# EAGLE schematic videoshield_alpha3 (EAGLE 6.6.0)
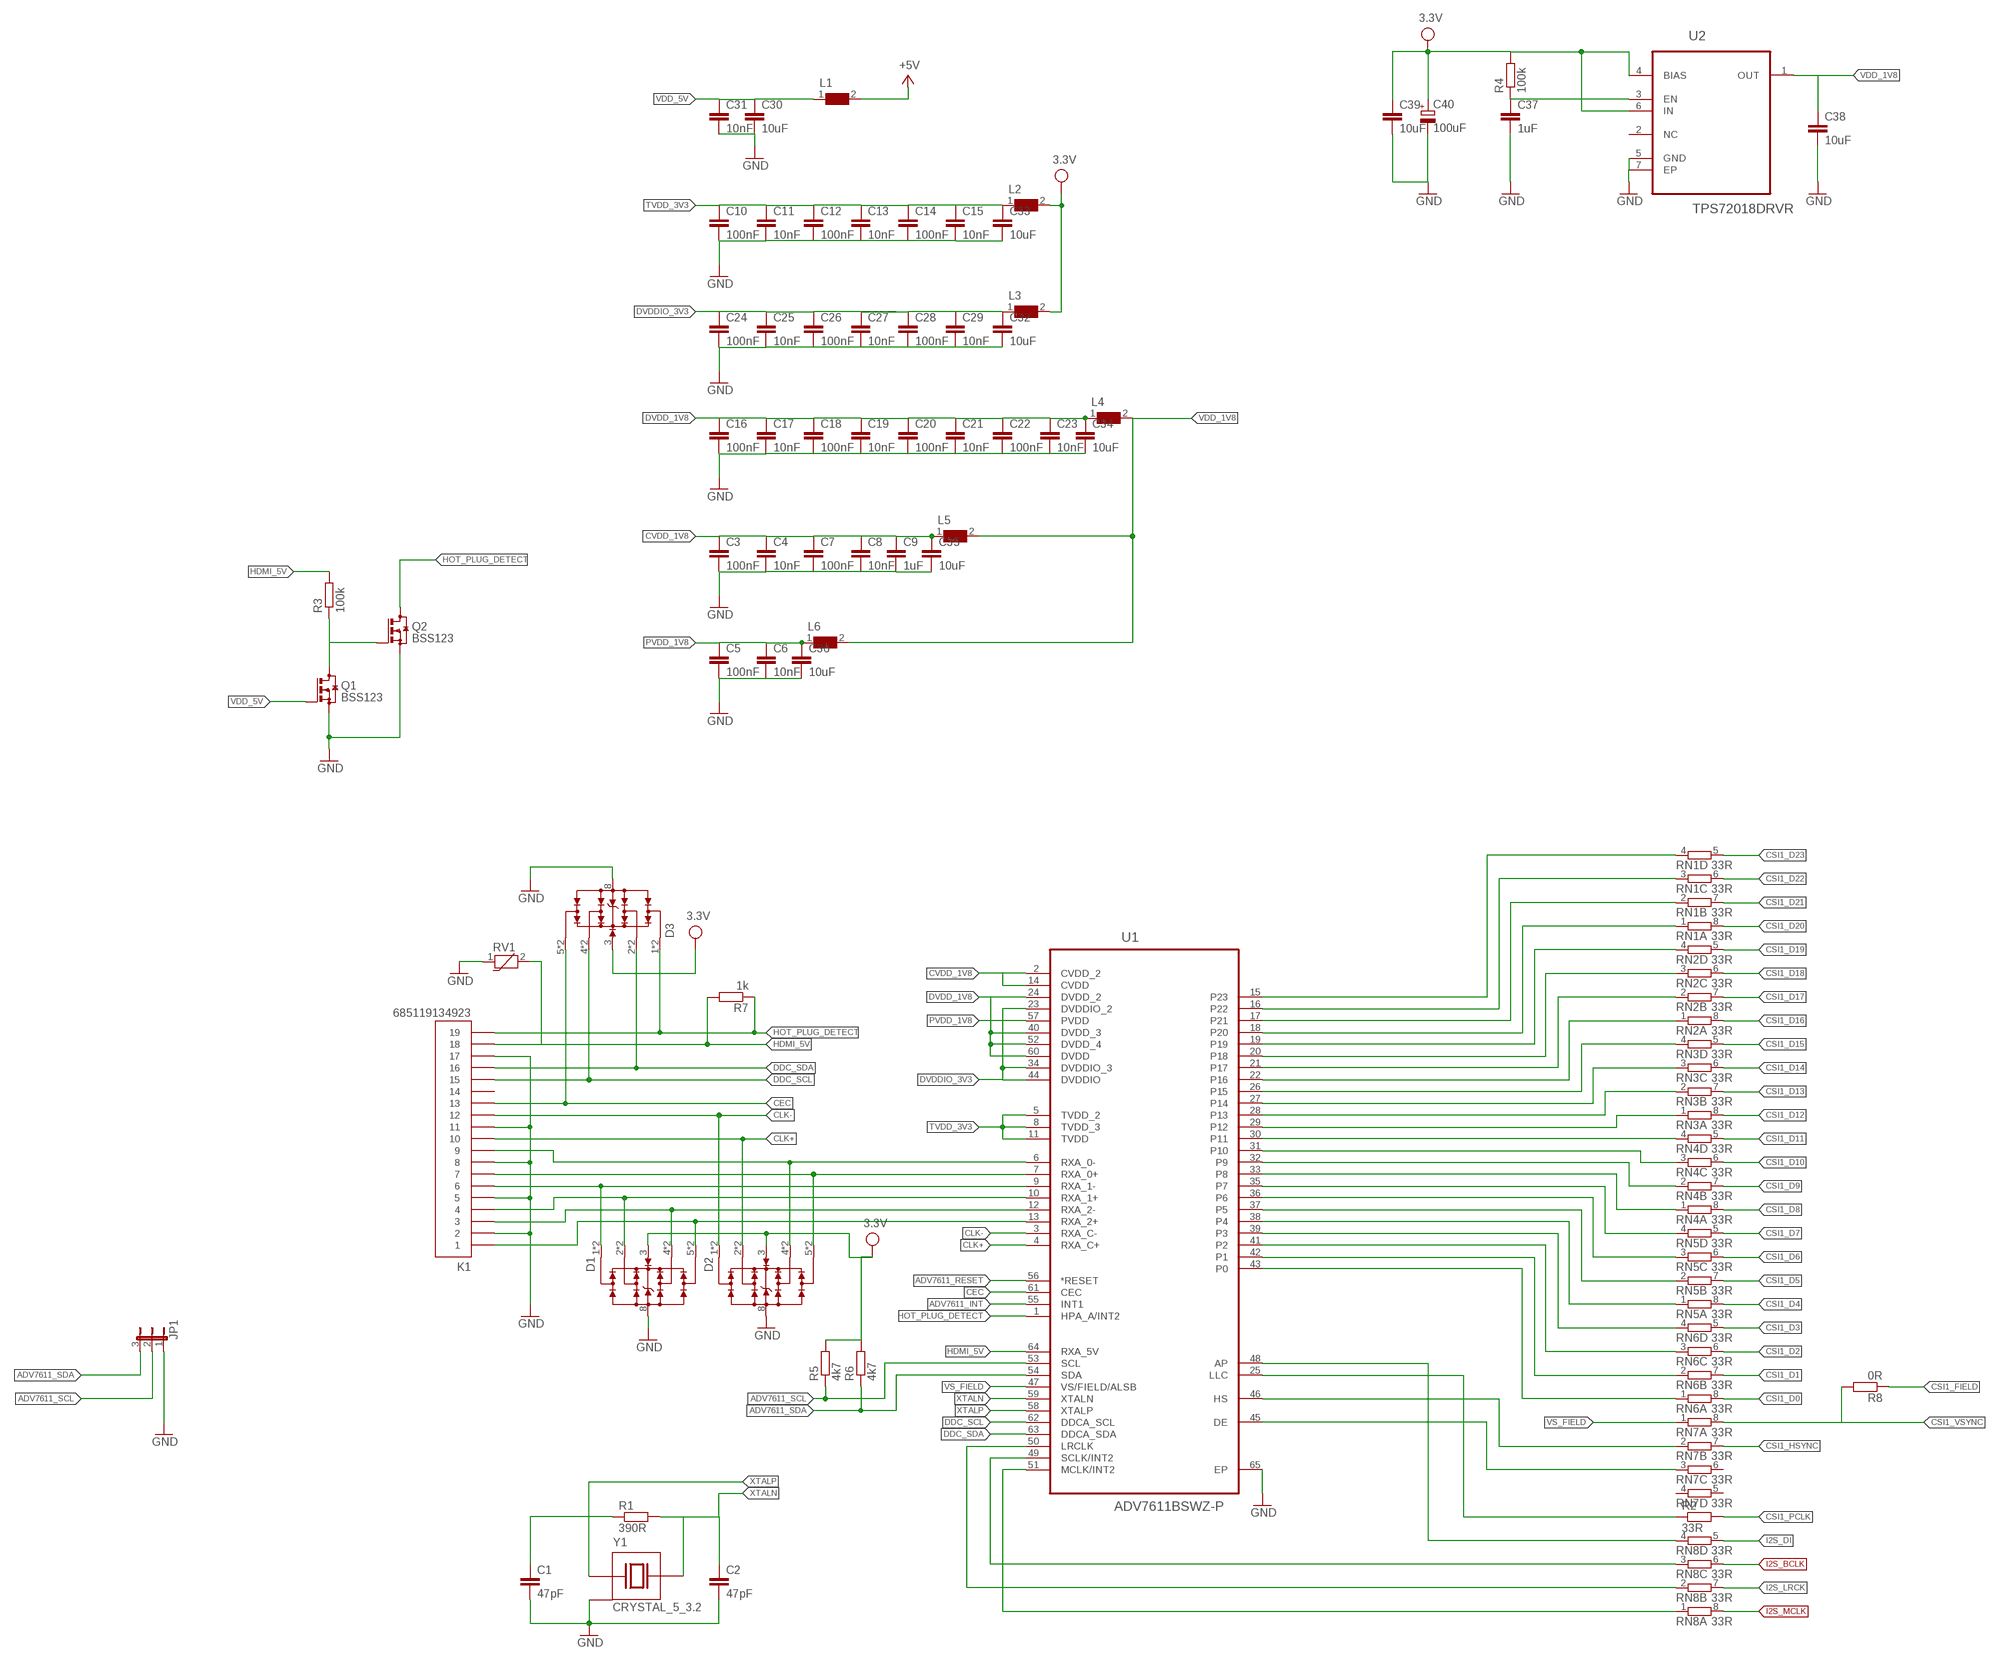
[diagram p0: schematic, sheet 1, part 1 of 3]
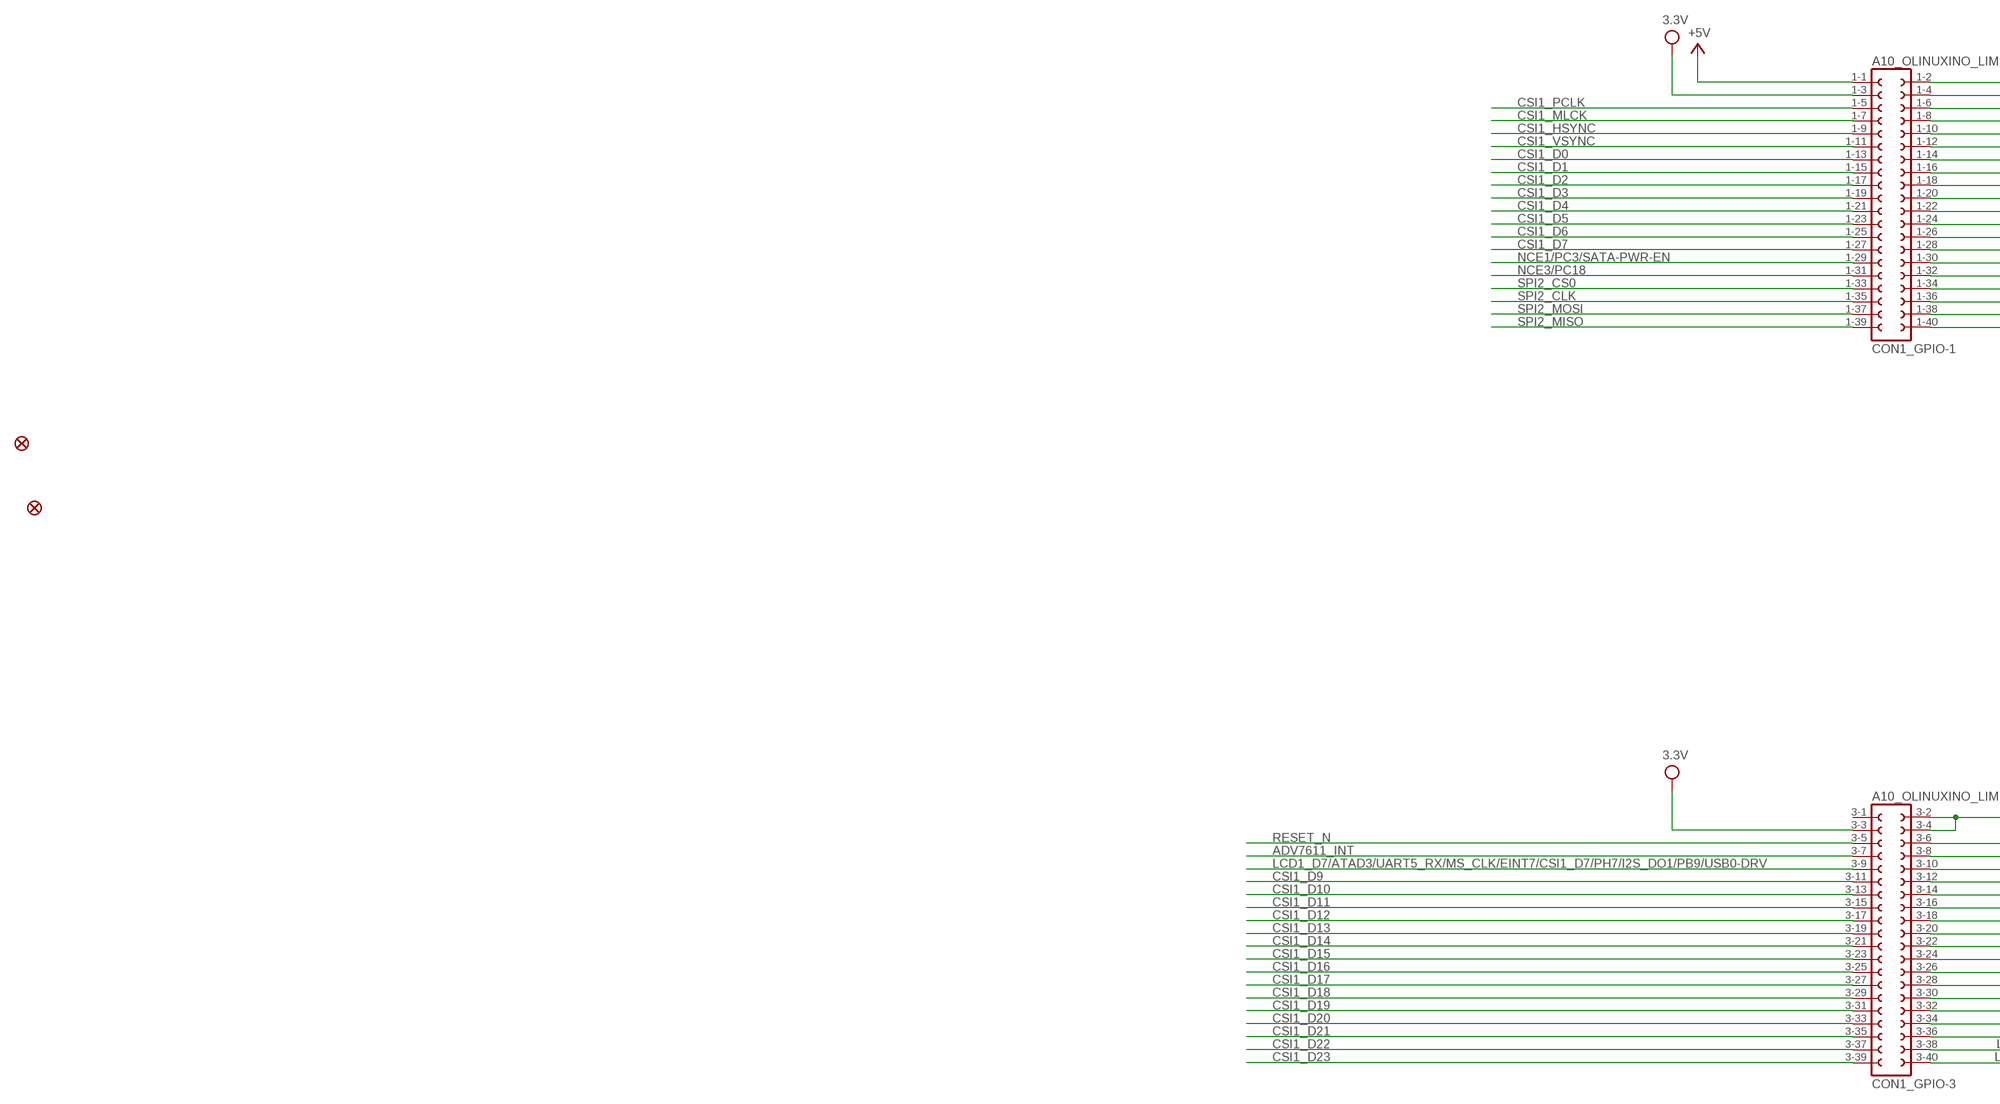
[diagram p1: schematic, sheet 1, part 2 of 3]
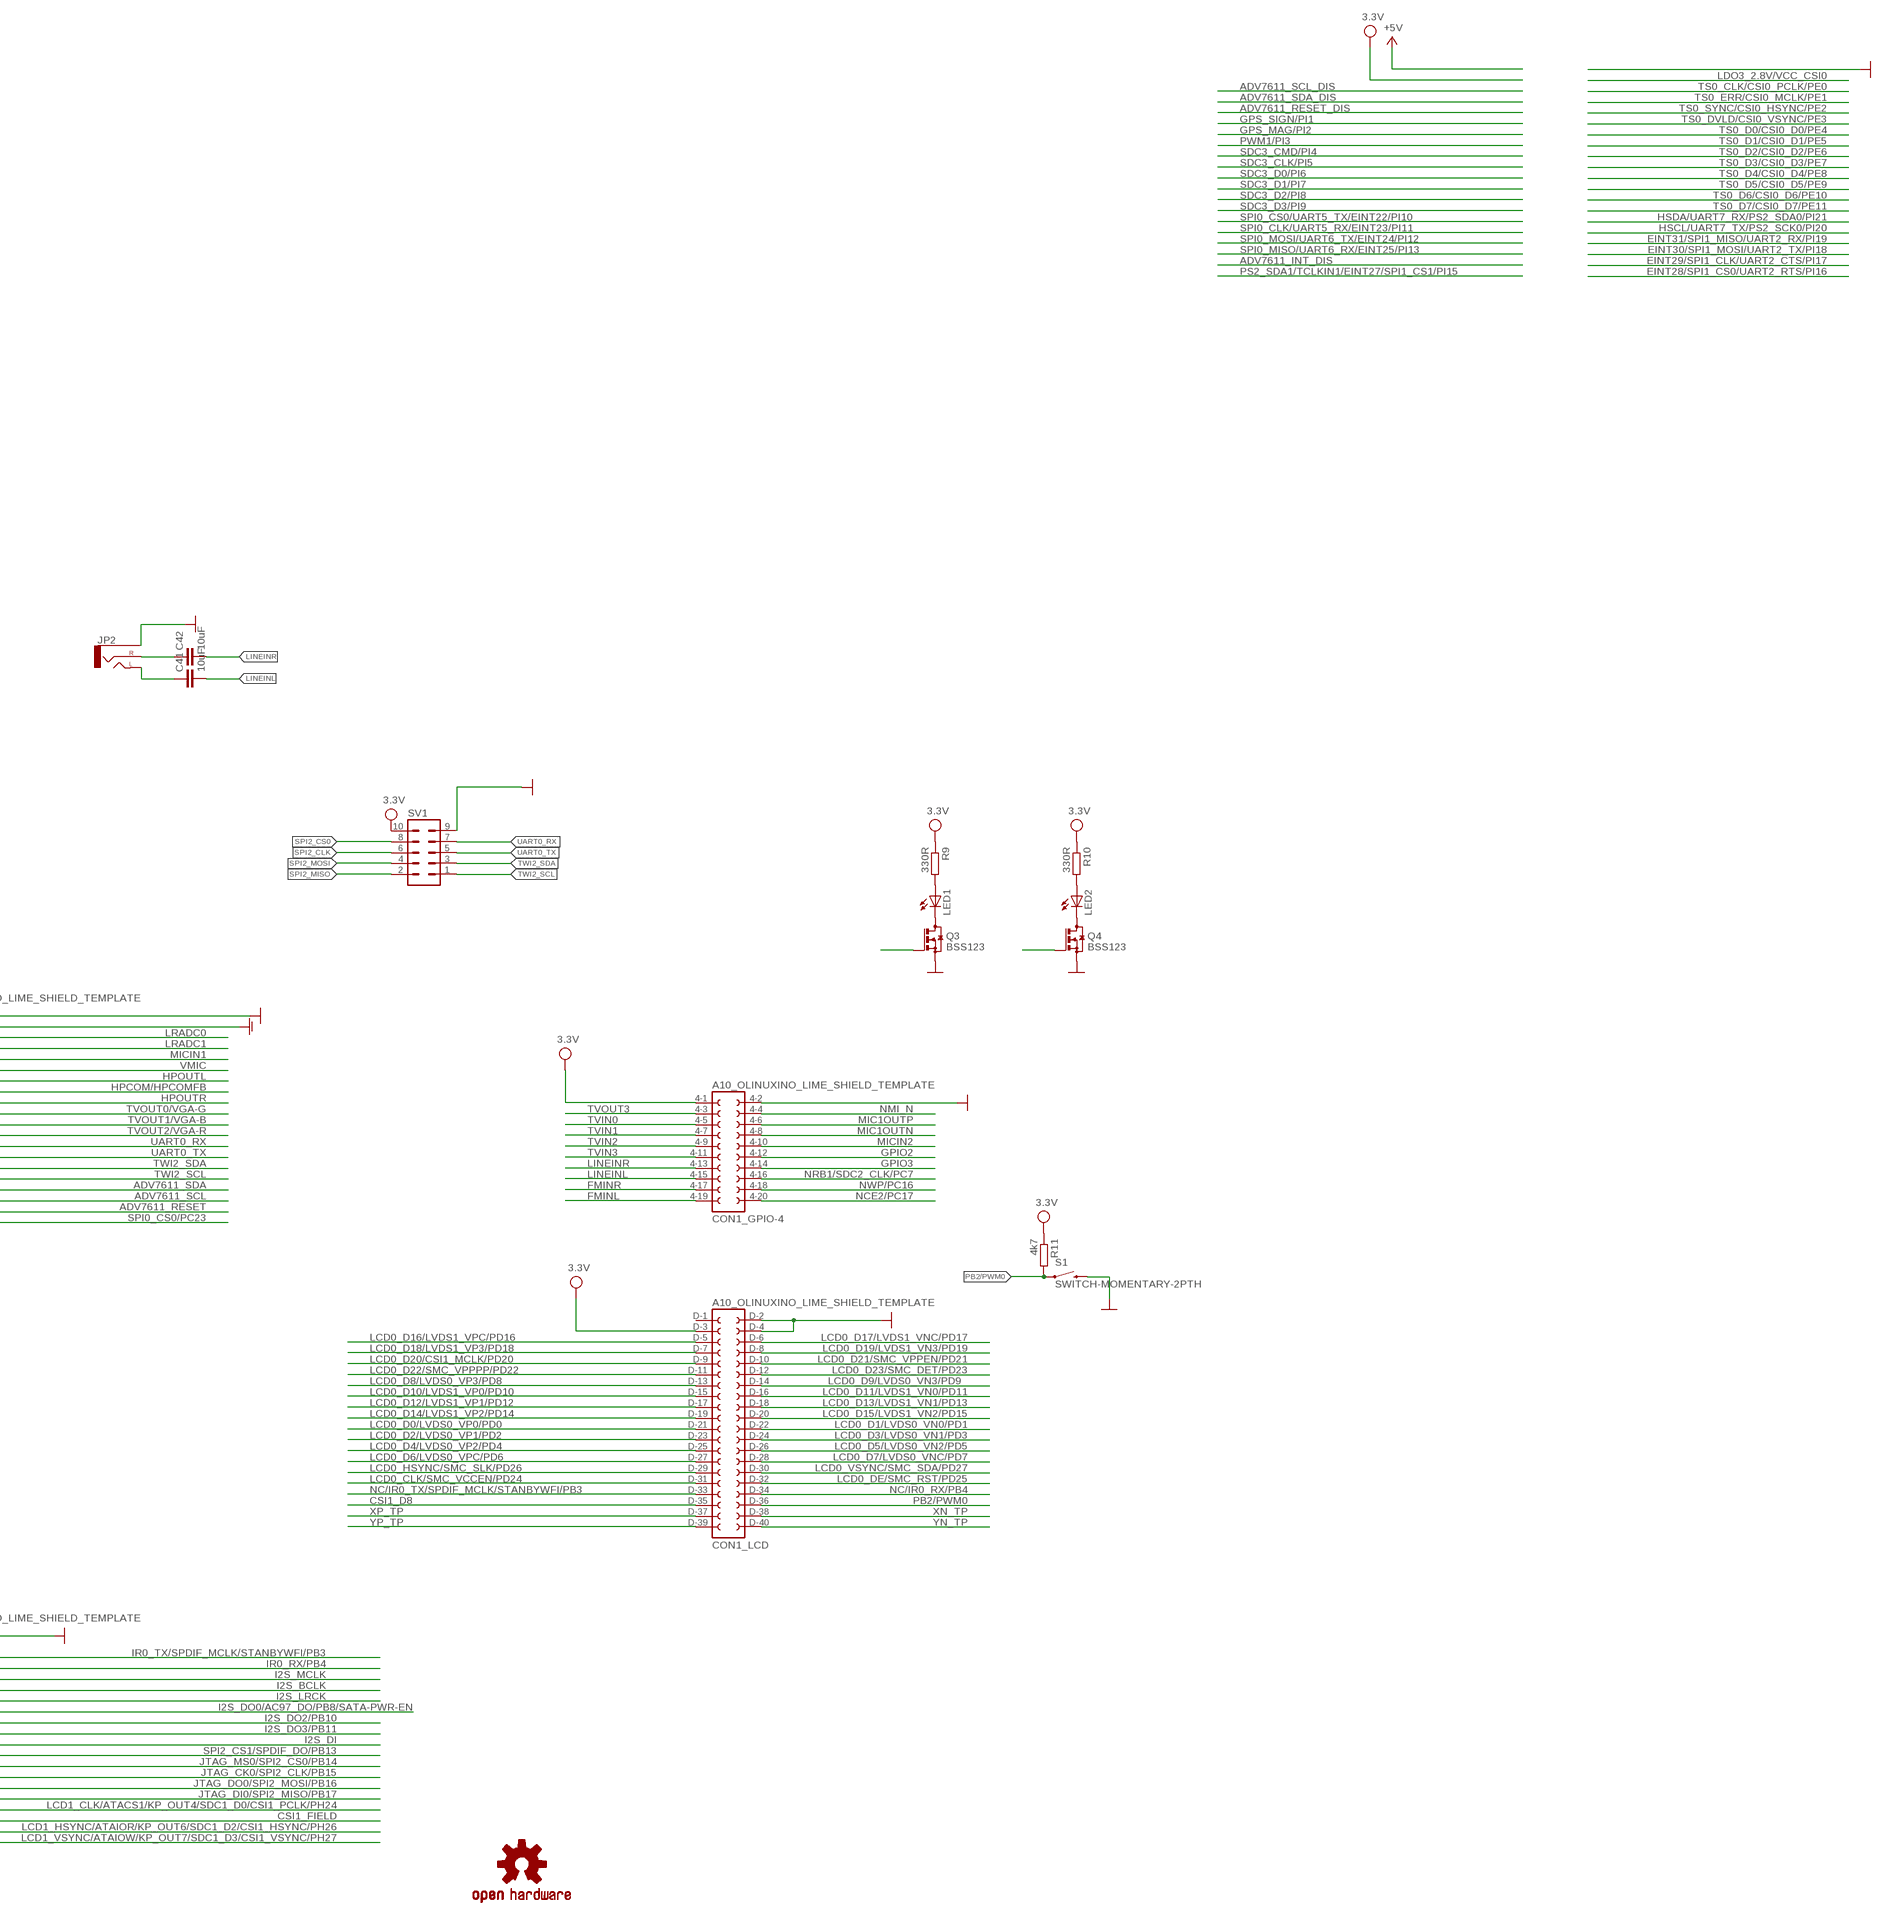
[diagram p2: schematic, sheet 1, part 3 of 3]

## Parts
C1  47pF  C-EUC0402  [C0402]
C2  47pF  C-EUC0402  [C0402]
C3  100nF  C-EUC0402  [C0402]
C4  10nF  C-EUC0402  [C0402]
C5  100nF  C-EUC0402  [C0402]
C6  10nF  C-EUC0402  [C0402]
C7  100nF  C-EUC0402  [C0402]
C8  10nF  C-EUC0402  [C0402]
C9  1uF  C-EUC0603  [C0603]
C10  100nF  C-EUC0402  [C0402]
C11  10nF  C-EUC0402  [C0402]
C12  100nF  C-EUC0402  [C0402]
C13  10nF  C-EUC0402  [C0402]
C14  100nF  C-EUC0402  [C0402]
C15  10nF  C-EUC0402  [C0402]
C16  100nF  C-EUC0402  [C0402]
C17  10nF  C-EUC0402  [C0402]
C18  100nF  C-EUC0402  [C0402]
C19  10nF  C-EUC0402  [C0402]
C20  100nF  C-EUC0402  [C0402]
C21  10nF  C-EUC0402  [C0402]
C22  100nF  C-EUC0402  [C0402]
C23  10nF  C-EUC0402  [C0402]
C24  100nF  C-EUC0402  [C0402]
C25  10nF  C-EUC0402  [C0402]
C26  100nF  C-EUC0402  [C0402]
C27  10nF  C-EUC0402  [C0402]
C28  100nF  C-EUC0402  [C0402]
C29  10nF  C-EUC0402  [C0402]
C30  10uF  C-EUC0805  [C0805]
C31  10nF  C-EUC0402  [C0402]
C32  10uF  C-EUC0805  [C0805]
C33  10uF  C-EUC0805  [C0805]
C34  10uF  C-EUC0805  [C0805]
C35  10uF  C-EUC0805  [C0805]
C36  10uF  C-EUC0805  [C0805]
C37  1uF  C-EUC0603  [C0603]
C38  10uF  C-EUC0805  [C0805]
C39  10uF  C-EUC0805  [C0805]
C40  100uF  CPOL-EU153CLV-0405  [153CLV-0405]
C41  10uF  C-EUC0805  [C0805]
C42  10uF  C-EUC0805  [C0805]
CON1  A10_OLINUXINO_LIME_SHIELD_TEMPLATE  [A10_OLINUXINO_LIME_SHIELD]
D1  WE-TVS_82401444  [WE-TVS_MSOP-10L]
D2  WE-TVS_82401444  [WE-TVS_MSOP-10L]
D3  WE-TVS_82401444  [WE-TVS_MSOP-10L]
FID1  FIDUCIALUFIDUCIAL  [MICRO-FIDUCIAL]
FID2  FIDUCIAL1X2  [FIDUCIAL-1X2]
JP1  JP2E  [JP2]
JP2  AUDIO-JACKPTH  [AUDIO-JACK]
K1  685119134923  [685119134923]
L1  WE-CBF-742792040_0805  [0805]
L2  WE-CBF-742792040_0805  [0805]
L3  WE-CBF-742792040_0805  [0805]
L4  WE-CBF-742792040_0805  [0805]
L5  WE-CBF-742792040_0805  [0805]
L6  WE-CBF-742792040_0805  [0805]
LED1  LEDCHIPLED_0805  [CHIPLED_0805]
LED2  LEDCHIPLED_0805  [CHIPLED_0805]
LOGO1  OSHW-LOGOL  [OSHW-LOGO-L]
Q1  BSS123  [SOT23]
Q2  BSS123  [SOT23]
Q3  BSS123  [SOT23]
Q4  BSS123  [SOT23]
R1  390R  R-EU_R0402  [R0402]
R2  33R  R-EU_R0402  [R0402]
R3  100k  R-EU_R0402  [R0402]
R4  100k  R-EU_R0402  [R0402]
R5  4k7  R-EU_R0402  [R0402]
R6  4k7  R-EU_R0402  [R0402]
R7  1k  R-EU_R0402  [R0402]
R8  0R  R-EU_R0402  [R0402]
R9  330R  R-EU_R0402  [R0402]
R10  330R  R-EU_R0402  [R0402]
R11  4k7  R-EU_R0402  [R0402]
RN1  33R  4R-N0402ARV341  [4X0402ARV341]
RN2  33R  4R-N0402ARV341  [4X0402ARV341]
RN3  33R  4R-N0402ARV341  [4X0402ARV341]
RN4  33R  4R-N0402ARV341  [4X0402ARV341]
RN5  33R  4R-N0402ARV341  [4X0402ARV341]
RN6  33R  4R-N0402ARV341  [4X0402ARV341]
RN7  33R  4R-N0402ARV341  [4X0402ARV341]
RN8  33R  4R-N0402ARV341  [4X0402ARV341]
RV1  WE-VS-82537040_0402  [WESURGE_0402]
S1  SWITCH-MOMENTARY-2PTH  [TACTILE-PTH]
SV1  MA05-2  [MA05-2]
U1  ADV7611BSWZ-P  [QFP50P1200X1200X160-65N]
U2  TPS72018DRVR  [SON65P200X200X80-7N]
Y1  CRYSTAL_5_3.2  [5MM_3.2MM]

## Nets
+5V: CON1.1-1 L1.2
ADV7611_INT: CON1.3-7 U1.55(INT1)
ADV7611_RESET: CON1.1-38 U1.56(*RESET)
ADV7611_SCL: CON1.1-36 JP1.2 R5.1 U1.53(SCL)
ADV7611_SDA: CON1.1-34 JP1.3 R6.1 U1.54(SDA)
CEC: D3.5 D3.6 K1.13 U1.61(CEC)
CLK+: D2.2 D2.9 K1.10 U1.4(RXA_C+)
CLK-: D2.1 D2.10 K1.12 U1.3(RXA_C-)
CSI1_D0: CON1.1-13 RN6.8
CSI1_D1: CON1.1-15 RN6.7
CSI1_D2: CON1.1-17 RN6.6
CSI1_D3: CON1.1-19 RN6.5
CSI1_D4: CON1.1-21 RN5.8
CSI1_D5: CON1.1-23 RN5.7
CSI1_D6: CON1.1-25 RN5.6
CSI1_D7: CON1.1-27 RN5.5
CSI1_D8: CON1.D-35 RN4.8
CSI1_D9: CON1.3-11 RN4.7
CSI1_D10: CON1.3-13 RN4.6
CSI1_D11: CON1.3-15 RN4.5
CSI1_D12: CON1.3-17 RN3.8
CSI1_D13: CON1.3-19 RN3.7
CSI1_D14: CON1.3-21 RN3.6
CSI1_D15: CON1.3-23 RN3.5
CSI1_D16: CON1.3-25 RN2.8
CSI1_D17: CON1.3-27 RN2.7
CSI1_D18: CON1.3-29 RN2.6
CSI1_D19: CON1.3-31 RN2.5
CSI1_D20: CON1.3-33 RN1.8
CSI1_D21: CON1.3-35 RN1.7
CSI1_D22: CON1.3-37 RN1.6
CSI1_D23: CON1.3-39 RN1.5
CSI1_FIELD: CON1.3-36 R8.1
CSI1_HSYNC: CON1.1-9 RN7.7
CSI1_MLCK: CON1.1-7
CSI1_PCLK: CON1.1-5 R2.2
CSI1_VSYNC: CON1.1-11 R8.2 RN7.8
CVDD_1V8: C3.1 C4.1 C7.1 C8.1 C9.1 C35.1 L5.1 U1.2(CVDD_2) U1.14(CVDD)
DDC_SCL: D3.4 D3.7 K1.15 U1.62(DDCA_SCL)
DDC_SDA: D3.2 D3.9 K1.16 U1.63(DDCA_SDA)
DVDD_1V8: C16.1 C17.1 C18.1 C19.1 C20.1 C21.1 C22.1 C23.1 C34.1 L4.1 U1.24(DVDD_2) U1.40(DVDD_3) U1.52(DVDD_4) U1.60(DVDD)
DVDDIO_3V3: C24.1 C25.1 C26.1 C27.1 C28.1 C29.1 C32.1 L3.1 U1.23(DVDDIO_2) U1.34(DVDDIO_3) U1.44(DVDDIO)
FMINL: CON1.4-19
FMINR: CON1.4-17
GND: C1.2 C2.2 C3.2 C4.2 C5.2 C6.2 C7.2 C8.2 C9.2 C10.2 C11.2 C12.2 C13.2 C14.2 C15.2 C16.2 C17.2 C18.2 C19.2 C20.2 C21.2 C22.2 C23.2 C24.2 C25.2 C26.2 C27.2 C28.2 C29.2 C30.2 C31.2 C32.2 C33.2 C34.2 C35.2 C36.2 C37.2 C38.2 C39.2 C40.- CON1.1-2 CON1.3-2 CON1.3-4 CON1.4-2 CON1.D-2 CON1.D-4 D1.8(GND) D2.8(GND) D3.8(GND) JP2.SLEEVE K1.2 K1.5 K1.8 K1.11 K1.17 Q1.2(S) Q2.2(S) Q3.2(S) Q4.2(S) RV1.1 S1.3 SV1.9 U1.65(EP) U2.5(GND) U2.7(EP) Y1.P$2 Y1.P$4#
GNDA: CON1.1-4
GPIO2: CON1.4-12 Q4.1(G)
GPIO3: CON1.4-14 Q3.1(G)
HDMI_5V: K1.18 R3.2 R7.2 RV1.2 U1.64(RXA_5V)
HOT_PLUG_DETECT: D3.1 D3.10 K1.19 Q2.3(D) R7.1 U1.1(HPA_A/INT2)
HPCOM/HPCOMFB: CON1.1-16
HPOUTL: CON1.1-14
HPOUTR: CON1.1-18
I2S_BCLK: CON1.3-12 RN8.6
I2S_DI: CON1.3-22 RN8.5
I2S_DO0/AC97_DO/PB8/SATA-PWR-EN: CON1.3-16
I2S_DO2/PB10: CON1.3-18
I2S_DO3/PB11: CON1.3-20
I2S_LRCK: CON1.3-14 RN8.7
I2S_MCLK: CON1.3-10 RN8.8
IR0_RX/PB4: CON1.3-8
IR0_TX/SPDIF_MCLK/STANBYWFI/PB3: CON1.3-6
JTAG_CK0/SPI2_CLK/PB15: CON1.3-28
JTAG_DI0/SPI2_MISO/PB17: CON1.3-32
JTAG_DO0/SPI2_MOSI/PB16: CON1.3-30
JTAG_MS0/SPI2_CS0/PB14: CON1.3-26
LCD0_CLK/SMC_VCCEN/PD24: CON1.D-31
LCD0_D0/LVDS0_VP0/PD0: CON1.D-21
LCD0_D1/LVDS0_VN0/PD1: CON1.D-22
LCD0_D2/LVDS0_VP1/PD2: CON1.D-23
LCD0_D3/LVDS0_VN1/PD3: CON1.D-24
LCD0_D5/LVDS0_VN2/PD5: CON1.D-26
LCD0_D6/LVDS0_VPC/PD6: CON1.D-27
LCD0_D9/LVDS0_VN3/PD9: CON1.D-14
LCD0_D10/LVDS1_VP0/PD10: CON1.D-15
LCD0_D11/LVDS1_VN0/PD11: CON1.D-16
LCD0_D12/LVDS1_VP1/PD12: CON1.D-17
LCD0_D13/LVDS1_VN1/PD13: CON1.D-18
LCD0_D14/LVDS1_VP2/PD14: CON1.D-19
LCD0_D15/LVDS1_VN2/PD15: CON1.D-20
LCD0_D16/LVDS1_VPC/PD16: CON1.D-5
LCD0_D17/LVDS1_VNC/PD17: CON1.D-6
LCD0_D18/LVDS1_VP3/PD18: CON1.D-7
LCD0_D19/LVDS1_VN3/PD19: CON1.D-8
LCD0_D20/CSI1_MCLK/PD20: CON1.D-9
LCD0_D21/SMC_VPPEN/PD21: CON1.D-10
LCD0_D22/SMC_VPPPP/PD22: CON1.D-11
LCD0_D23/SMC_DET/PD23: CON1.D-12
LCD0_DE/SMC_RST/PD25: CON1.D-32
LCD0_HSYNC/SMC_SLK/PD26: CON1.D-29
LCD0_VSYNC/SMC_SDA/PD27: CON1.D-30
LCD1_CLK/ATACS1/KP_OUT4/SDC1_D0/CSI1_PCLK/PH24: CON1.3-34
LCD1_D7/ATAD3/UART5_RX/MS_CLK/EINT7/CSI1_D7/PH7/I2S_DO1/PB9/USB0-DRV: CON1.3-9
LCD1_HSYNC/ATAIOR/KP_OUT6/SDC1_D2/CSI1_HSYNC/PH26: CON1.3-38
LCD1_VSYNC/ATAIOW/KP_OUT7/SDC1_D3/CSI1_VSYNC/PH27: CON1.3-40
LINEINL: C41.2 CON1.4-15
LINEINR: C42.2 CON1.4-13
LRADC0: CON1.1-6
LRADC1: CON1.1-8
MIC1OUTN: CON1.4-8
MIC1OUTP: CON1.4-6
MICIN1: CON1.1-10
MICIN2: CON1.4-10
N$1: D1.5 D1.6 K1.1 U1.13(RXA_2+)
N$2: D1.4 D1.7 K1.3 U1.12(RXA_2-)
N$3: D1.2 D1.9 K1.4 U1.10(RXA_1+)
N$4: D1.1 D1.10 K1.6 U1.9(RXA_1-)
N$5: D2.5 D2.6 K1.7 U1.7(RXA_0+)
N$6: D2.4 D2.7 K1.9 U1.6(RXA_0-)
N$7: RN1.4 U1.15(P23)
N$8: RN1.3 U1.16(P22)
N$9: RN1.2 U1.17(P21)
N$10: RN1.1 U1.18(P20)
N$11: RN2.4 U1.19
N$12: RN2.3 U1.20(P18)
N$13: RN2.2 U1.21(P17)
N$14: RN2.1 U1.22(P16)
N$15: RN3.4 U1.26(P15)
N$16: RN3.3 U1.27(P14)
N$17: RN3.2 U1.28(P13)
N$18: RN3.1 U1.29(P12)
N$19: RN4.4 U1.30(P11)
N$20: RN4.3 U1.31(P10)
N$21: RN4.2 U1.32(P9)
N$22: RN4.1 U1.33(P8)
N$23: RN5.4 U1.35(P7)
N$24: RN5.3 U1.36(P6)
N$25: RN5.2 U1.37(P5)
N$26: RN5.1 U1.38(P4)
N$27: RN6.4 U1.39(P3)
N$28: RN6.3 U1.41(P2)
N$29: RN6.2 U1.42(P1)
N$30: RN6.1 U1.43(P0)
N$31: RN8.4 U1.48(AP)
N$32: RN7.2 U1.46(HS)
N$33: RN7.3 U1.45(DE)
N$34: R2.1 U1.25(LLC)
N$35: RN8.3 U1.49(SCLK/INT2)
N$36: Q1.3(D) Q2.1(G) R3.1
N$37: RN8.2 U1.50(LRCLK)
N$38: RN8.1 U1.51(MCLK/INT2)
N$39: C37.1 R4.1 U2.3(EN)
N$40: LED1.C Q3.3(D)
N$41: LED1.A R9.2
N$42: JP1.1 ; supply symbol labelled GND
N$43: LED2.A R10.2
N$44: LED2.C Q4.3(D)
N$45: C42.1 JP2.RING(RIGHT)
N$46: C41.1 JP2.TIP(LEFT)
NC/IR0_RX/PB4: CON1.D-34
NC/IR0_TX/SPDIF_MCLK/STANBYWFI/PB3: CON1.D-33
NCE1/PC3/SATA-PWR-EN: CON1.1-29
NCE2/PC17: CON1.4-20
NCE3/PC18: CON1.1-31
NMI_N: CON1.4-4
NRB1/SDC2_CLK/PC7: CON1.4-16
NWP/PC16: CON1.4-18
PB2/PWM0: CON1.D-36 R11.2 S1.1
PVDD_1V8: C5.1 C6.1 C36.1 L6.1 U1.57(PVDD)
RESET_N: CON1.3-5
SPI0_CS0/PC23: CON1.1-40
SPI2_CLK: CON1.1-35 SV1.6
SPI2_CS0: CON1.1-33 SV1.8
SPI2_CS1/SPDIF_DO/PB13: CON1.3-24
SPI2_MISO: CON1.1-39 SV1.2
SPI2_MOSI: CON1.1-37 SV1.4
TVDD_3V3: C10.1 C11.1 C12.1 C13.1 C14.1 C15.1 C33.1 L2.1 U1.5(TVDD_2) U1.8(TVDD_3) U1.11(TVDD)
TVIN0: CON1.4-5
TVIN1: CON1.4-7
TVIN2: CON1.4-9
TVIN3: CON1.4-11
TVOUT0/VGA-G: CON1.1-20
TVOUT1/VGA-B: CON1.1-22
TVOUT2/VGA-R: CON1.1-24
TVOUT3: CON1.4-3
TWI2_SCL: CON1.1-32 SV1.1
TWI2_SDA: CON1.1-30 SV1.3
UART0_RX: CON1.1-26 SV1.7
UART0_TX: CON1.1-28 SV1.5
VCC: C39.1 C40.+ CON1.1-3 CON1.3-3 CON1.4-1 CON1.D-3 D1.3(VDD) D2.3(VDD) D3.3(VDD) L2.2 L3.2 R4.2 R5.2 R6.2 R9.1 R10.1 R11.1 SV1.10 U2.4(BIAS) U2.6(IN) ; supply symbol labelled 3.3V
VDD_1V8: C38.1 L4.2 L5.2 L6.2 U2.1(OUT)
VDD_5V: C30.1 C31.1 L1.1 Q1.1(G)
VMIC: CON1.1-12
VS_FIELD: RN7.1 U1.47(VS/FIELD/ALSB)
XN_TP: CON1.D-38
XP_TP: CON1.D-37
XTALN: C2.1 R1.2 U1.59(XTALN) Y1.P$3
XTALP: C1.1 R1.1 U1.58(XTALP) Y1.P$1
YP_TP: CON1.D-39
Unconnected: CON1.3-1 CON1.D-1 CON1.D-13 CON1.D-25 CON1.D-28 CON1.D-40 K1.14 RN7.4 RN7.5 RN7.6 U2.2(NC)

## Library data of the parts
C1-C39 C41 C42 = rcl:C-EU: CAPACITOR, European symbol
C40 = rcl:CPOL-EU: POLARIZED CAPACITOR, European symbol
CON1 = A10_OLIMEXINO_LIME_SHIELD:A10_OLINUXINO_LIME_SHIELD_TEMPLATE
D1-D3 = WE-TVS_82401444:WE-TVS_82401444: TVS Diode Array WE-TVS, Super Speed Serie - Low capazity - No leakage current - Low clamping voltage - high ESD voltage protection -- SATA -- DisplayPort -- DVI -- HDMI; MPN: 82401444; OC_FARNELL: 1825863; OC_NEWARK: 79R6952; PACKAGE: MSOP-10L; SUPPLIER: Wuerth Elektronik
FID1 FID2 = SparkFun-Aesthetics:FIDUCIAL: Fiducial Alignment Points Various fiducial points for machine vision alignment.
JP1 = jumper:JP2E: JUMPER
JP2 = SparkFun-Connectors:AUDIO-JACK: 3.5mm Audio Jack Simple 3.5mm common PCB mount audio jack. SKU: PRT-08032
K1 = InputOutputIO:685119134923: WR-COM SMT Horizontal HDMI, 19 pins
L1-L6 = WE-CBF:WE-CBF: SMD EMI Suppression Ferrite Beads WE-CBF - Excellent anti-EMI properties - Low DC-restistance - Impedances till 3000 ohms - Rated current up to 6 A -- Reliable Ni-Sn electrodes -- Perfect as data lined filter and for uncoupling of distribution voltage; MPN: 742792040; OC_FARNELL: 1635735; OC_NEWARK: 08P2371; PACKAGE: IND-0805; SUPPLIER: Wuerth Elektronik
LED1 LED2 = led:LED: LED OSRAM: - CHIPLED LG R971, LG N971, LY N971, LG Q971, LY Q971, LO R971, LY R971 LH N974, LH R974 LS Q976, LO Q976, LY Q976 LO Q996 - Hyper CHIPLED LW Q18S LB Q993, LB Q99A, LB R99A - SideLED LS A670, LO A670, LY A670, LG A670, LP A670 LB A673, LV A673, LT A673, LW A673 LH A674 LY A675 LS A676, LA A676, LO A676, LY A676, LW A676 LS A679, LY A679, LG A679 - Hyper Micro SIDELED® LS Y876, LA Y876, LO Y876, LY Y876 LT Y87S - SmartLED LW L88C, LW L88S LB L89C, LB L89S, LG L890 LS L89K, LO L89K, LY L89K LS L896, LA L896, LO L896, LY L896 - TOPLED LS T670, LO T670, LY T670, LG T670, LP T670 LSG T670, LSP T670, LSY T670, LOP T670, LYG T670 LG T671, LOG T671, LSG T671 LB T673, LV T673, LT T673, LW T673 LH T674 LS T676, LA T676, LO T676, LY T676, LB T676, LH T676, LSB T676, LW T676 LB T67C, LV T67C, LT T67C, LS T67K, LO T67K, LY T67K, LW E67C LS E67B, LA E67B, LO E67B, LY E67B, LB E67C, LV E67C, LT E67C LW T67C LS T679, LY T679, LG T679 LS T770, LO T770, LY T770, LG T770, LP T770 LB T773, LV T773, LT T773, LW T773 LH T774 LS E675, LA E675, LY E675, LS T675 LS T776, LA T776, LO T776, LY T776, LB T776 LHGB T686 LT T68C, LB T68C - Hyper Mini TOPLED® LB M676 - Mini TOPLED Santana® LG M470 LS M47K, LO M47K, LY M47K Source: http://www.osram.convergy.de LUXEON: - LUMILED® LXK2-PW12-R00, LXK2-PW12-S00, LXK2-PW14-U00, LXK2-PW14-V00 LXK2-PM12-R00, LXK2-PM12-S00, LXK2-PM14-U00 LXK2-PE12-Q00, LXK2-PE12-R00, LXK2-PE12-S00, LXK2-PE14-T00, LXK2-PE14-U00 LXK2-PB12-K00, LXK2-PB12-L00, LXK2-PB12-M00, LXK2-PB14-N00, LXK2-PB14-P00, LXK2-PB14-Q00 LXK2-PR12-L00, LXK2-PR12-M00, LXK2-PR14-Q00, LXK2-PR14-R00 LXK2-PD12-Q00, LXK2-PD12-R00, LXK2-PD12-S00 LXK2-PH12-R00, LXK2-PH12-S00 LXK2-PL12-P00, LXK2-PL12-Q00, LXK2-PL12-R00 Source: www.luxeon.com KINGBRIGHT: KA-3528ASYC Source: www.kingbright.com
LOGO1 = SparkFun-Aesthetics:OSHW-LOGO: Open Source Hardware Logo This logo indicates the piece of hardware it is found on incorporates a OSHW license and/or adheres to the definition of open source hardware found here: http://freedomdefined.org/OSHW
Q1-Q4 = transistor-small-signal:BSS123: N-CHANNEL MOS FET
R1-R11 = resistor:R-EU_: RESISTOR, European symbol
RN1-RN8 = resistor-dil:4R-N: Array Chip Resistor Source: RS Component / Phycomp; OC_FARNELL: unknown; OC_NEWARK: unknown
RV1 = WE-VS:WE-VS: WESURGE SMD Varistor WE-VS - Fast response time - Low leakage current - Low clamping voltage - Wide range of voltage avaible - Almost no energy consumption in stand-by mode - Excellent absorption at surge-impulses - Nickel barrier for leadfree soldering - Operating temperature: -40°C to +85°C for size 0402 to 0805; -40°C to +1255°C for size 1206 to 2220 -- Protection of DC distribution -- Protection of power supply -- Protection of semiconductors -- Protection of bus systems and communication lines -- Limiting of over-voltage -- ESD protection in accordance with EN 61000-4-2 and Surge protection in accordance with EN 61000-4-5; MPN: 82537040; OC_FARNELL: 1636429; OC_NEWARK: 08P3016; PACKAGE: 0402; SUPPLIER: WURTH ELEKTRONIK
S1 = SparkFun-Electromechanical:SWITCH-MOMENTARY-2: Various NO switches- pushbuttons, reed, etc
SV1 = con-lstb:MA05-2: PIN HEADER; OC_FARNELL: unknown; OC_NEWARK: unknown
U1 = ADI-Phase-2:ADV7611BSWZ-P: Low Power 165 MHz HDMI Receiver,LQFP-64; MPN: ADV7611BSWZ-P; OC_FARNELL: 1903660; OC_NEWARK: 45T0201; PACKAGE: LQFP-64; SUPPLIER: Analog Devices
U2 = Texas Instruments_By_element14_Batch_1:TPS72018DRVR: 350mA, Ultra-Low VIN, RF Low-Dropout Linear Regulator with Bias Pin; MPN: TPS72018DRVR; OC_FARNELL: -; OC_NEWARK: 69R0453; PACKAGE: SON-6; SUPPLIER: Texas Instruments
Y1 = xtals:CRYSTAL_5_3.2